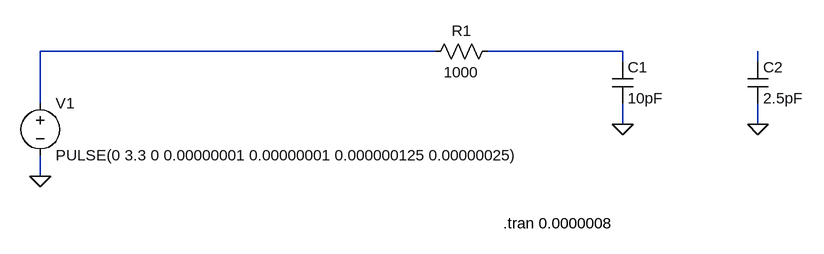
[diagram p0: schematic CapSensorTest.asc]
CapSensorTest.asc, the LTspice schematic file:
Version 4
SHEET 1 1288 680
WIRE 720 224 112 224
WIRE 1008 224 800 224
WIRE 1008 240 1008 224
WIRE 1216 240 1216 224
WIRE 112 304 112 224
WIRE 1008 336 1008 304
WIRE 1216 336 1216 304
WIRE 112 416 112 384
FLAG 112 416 0
FLAG 1216 336 0
FLAG 1008 336 0
SYMBOL voltage 112 288 R0
SYMATTR InstName V1
SYMATTR Value PULSE(0 3.3 0 0.00000001 0.00000001 0.000000125 0.00000025)
SYMBOL res 816 208 R90
WINDOW 0 0 56 VBottom 2
WINDOW 3 32 56 VTop 2
SYMATTR InstName R1
SYMATTR Value 1000
SYMBOL cap 992 240 R0
SYMATTR InstName C1
SYMATTR Value 10pF
SYMBOL cap 1200 240 R0
SYMATTR InstName C2
SYMATTR Value 2.5pF
TEXT 824 488 Left 2 !.tran 0.0000008

The netlist it stands for:
* CapSensorTest.asc
V1 N001 0 PULSE(0 3.3 0 0.00000001 0.00000001 0.000000125 0.00000025)
R1 N002 N001 1000
C1 N002 0 10pF
C2 N003 0 2.5pF
.tran 0.0000008
.backanno
.end